# Altium project ft4222.PrjPCB
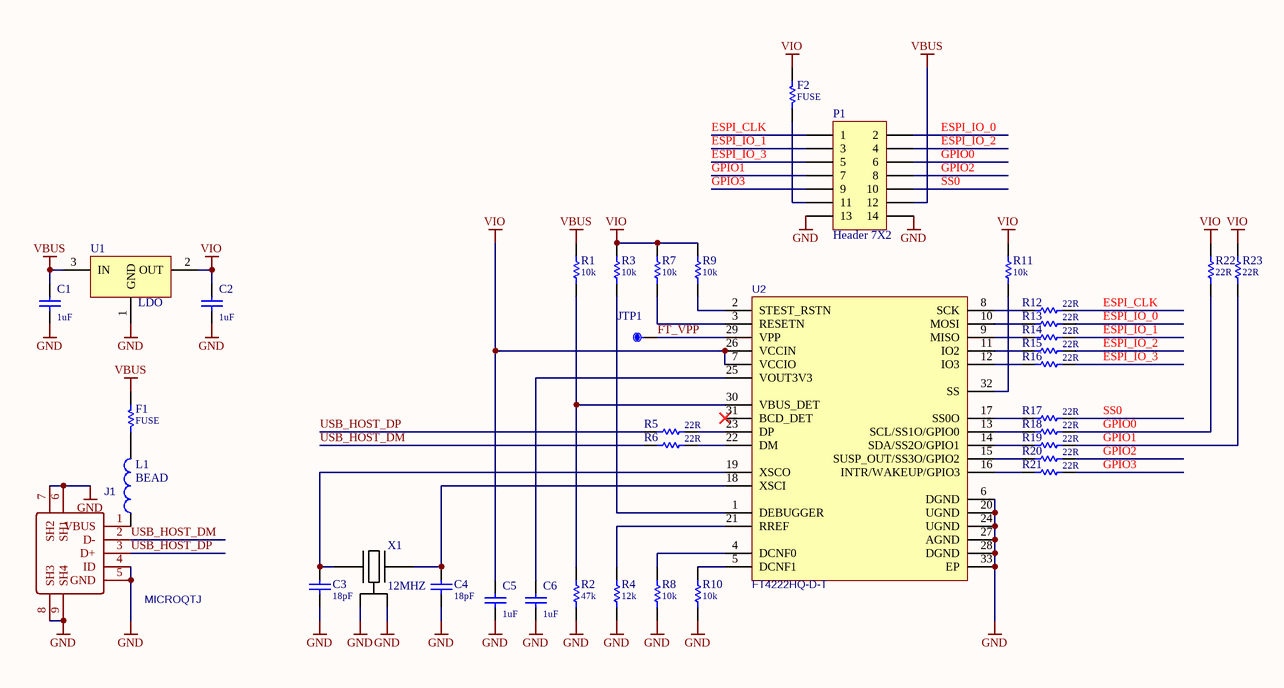
[diagram p0: ft4222.SchDoc]
PRJ_VER: v1.0.0; PRJ_ID: FT4222
1 sheet, 38 parts. Net scope: global (net labels, ports and power ports of the same name join across sheets).
Board file: ft4222.PcbDoc

## Sheet ft4222.SchDoc: Connector 300Pins
size A4; SheetNumber: 8; SheetTotal: 29

### Parts
C1  1uF  [C0603]
C2  1uF  [C0603]
C3  18pF  [C0402]
C4  18pF  [C0402]
C5  1uF  [C0603]
C6  1uF  [C0603]
F1  FUSE  [R1206]
F2  FUSE  [R1206]
J1  MICROQTJ  [MICRO-USB-SMD_MICROQTJ]
JTP1  (no value)  [TP30_SMD]
L1  BEAD  [L0402]
P1  Header 7X2  [HDR2X7]
R1  10k  [R0603]
R2  47k  [R0603]
R3  10k  [R0603]
R4  12k  [R0603]
R5  22R  [R0603]
R6  22R  [R0603]
R7  10k  [R0603]
R8  10k  [R0603]
R9  10k  [R0603]
R10  10k  [R0603]
R11  10k  [R0603]
R12  22R  [R0603]
R13  22R  [R0603]
R14  22R  [R0603]
R15  22R  [R0603]
R16  22R  [R0603]
R17  22R  [R0603]
R18  22R  [R0603]
R19  22R  [R0603]
R20  22R  [R0603]
R21  22R  [R0603]
R22  22R  [R0603]
R23  22R  [R0603]
U1  LDO  [TO-252AA (DPAK)]
U2  FT4222HQ-D-T  [QFN-32_L5.0-W5.0-P0.50-BL-EP3.7]
X1  12MHZ  [CRYSTAL_3.2x2.5mm]

### Nets
GND: C1.1 C2.1 C3.1 C4.1 C5.1 C6.1 J1.4(ID) J1.5(GND) J1.6(SH1) J1.7(SH2) J1.8(SH3) J1.9(SH4) P1.13 P1.14 R2.1 R4.1 R8.1 R10.1 U1.1(GND) U2.6(DGND) U2.20(UGND) U2.24(UGND) U2.27(AGND) U2.28(DGND) U2.33(EP) X1.2(GND) X1.4(GND)
VBUS: C1.2 F1.2 P1.12 R1.2 U1.3(IN)
VIO: C2.2 C5.2 F2.2 R3.2 R7.2 R9.2 R11.2 R22.1 R23.1 U1.2(OUT) U2.7(VCCIO) U2.26(VCCIN)
ESPI_CLK: P1.1 R12.1
ESPI_IO_0: P1.2 R13.1
ESPI_IO_1: P1.3 R14.1
ESPI_IO_2: P1.4 R15.1
ESPI_IO_3: P1.5 R16.1
FT_VPP: JTP1.1 U2.29(VPP)
GPIO0: P1.6 R18.1 R22.2
GPIO1: P1.7 R19.1 R23.2
GPIO2: P1.8 R20.1
GPIO3: P1.9 R21.1
SS0: P1.10 R17.1
USB_HOST_DM: J1.2(D-) R6.2
USB_HOST_DP: J1.3(D+) R5.2
NetC3_2: C3.2 U2.19(XSCO) X1.1(X1)
NetC4_2: C4.2 U2.18(XSCI) X1.3(X2)
NetC6_2: C6.2 U2.25(VOUT3V3)
NetF1_1: F1.1 L1.1
NetF2_1: F2.1 P1.11
NetJ1_1: J1.1(VBUS) L1.2
NetR1_1: R1.1 R2.2 U2.30(VBUS_DET)
NetR3_1: R3.1 U2.1(DEBUGGER)
NetR4_2: R4.2 U2.21(RREF)
NetR5_1: R5.1 U2.23(DP)
NetR6_1: R6.1 U2.22(DM)
NetR7_1: R7.1 U2.3(RESETN)
NetR8_2: R8.2 U2.4(DCNF0)
NetR9_1: R9.1 U2.2(STEST_RSTN)
NetR10_2: R10.2 U2.5(DCNF1)
NetR11_1: R11.1 U2.32(SS)
NetR12_2: R12.2 U2.8(SCK)
NetR13_2: R13.2 U2.10(MOSI)
NetR14_2: R14.2 U2.9(MISO)
NetR15_2: R15.2 U2.11(IO2)
NetR16_2: R16.2 U2.12(IO3)
NetR17_2: R17.2 U2.17(SS0O)
NetR18_2: R18.2 U2.13(SCL/SS1O/GPIO0)
NetR19_2: R19.2 U2.14(SDA/SS2O/GPIO1)
NetR20_2: R20.2 U2.15(SUSP_OUT/SS3O/GPIO2)
NetR21_2: R21.2 U2.16(INTR/WAKEUP/GPIO3)

Not connected (* = marked no-connect by the designer): U2 31(BCD_DET)*

### Library data of the parts
C1 C2 C5 C6 = CAP: 1uF 25V X7R 0603; P/N: 0603B105K250NT; LCSC part number: C59302
C3 C4 = CAP: 18pF 50V 0402; P/N: GRM1555C1H180JA01D; LCSC part number: C33149
F1 F2 = RES: P/N: RC0603FR-0710KL
J1 = MICROQTJ: BOM_Manufacturer: SHOU HAN; Contributor: LCSC; BOM_Supplier: LCSC; BOM_Supplier Part: C404968; BOM_Manufacturer Part: MicroQTJ; BOM_JLCPCB Part Class: Extended Part; spicePre: U; spiceSymbolName: MICROQTJ
JTP1 = TP_Dup1: PCB Footprint: TP30_SMD
L1 = BLM18AG601SN1D: INDUCTOR FERRITE BEAD 200mA 1 650mΩ 0402; P/N: CBG100505U600T; LCSC part number: C92615
P1 = Header 7X2: Header, 7-Pin, Dual row; LatestRevisionDate: 17-Jul-2002; LatestRevisionNote: Re-released for DXP Platform.; Publisher: Altium Limited
R1 R3 R7-R11 = RES: 10k 0603; P/N: RC0603FR-0710KL
R2 = RES: 47k 0603; P/N: RC0603FR-0747KL
R4 = RES: 12k 0603; P/N: RC0603FR-0712KL; LCSC part number: C114659
R5 R6 R12-R23 = RES: 22R 5% 0603; P/N: RC0603FR-0722RL
U1 = NCP51460SN33T1G
U2 = FT4222HQ-D-T: BOM_Manufacturer: FTDI(飞特帝亚); Contributor: lcsc; BOM_Supplier: LCSC; BOM_Supplier Part: C910592; BOM_Manufacturer Part: FT4222HQ-D-T; link: https://atta.szlcsc.comnull; BOM_JLCPCB Part Class: Extended Part; spicePre: U; spiceSymbolName: FT4222HQ-D-T
X1 = CRYSTAL 12MHZ 3.20mm x 2.50mm: CRYSTAL 12MHZ 10PF SMD; P/N: X322512MOB4SI; LCSC part number: C70565